# EAGLE design pots (EAGLE 6.6.0)
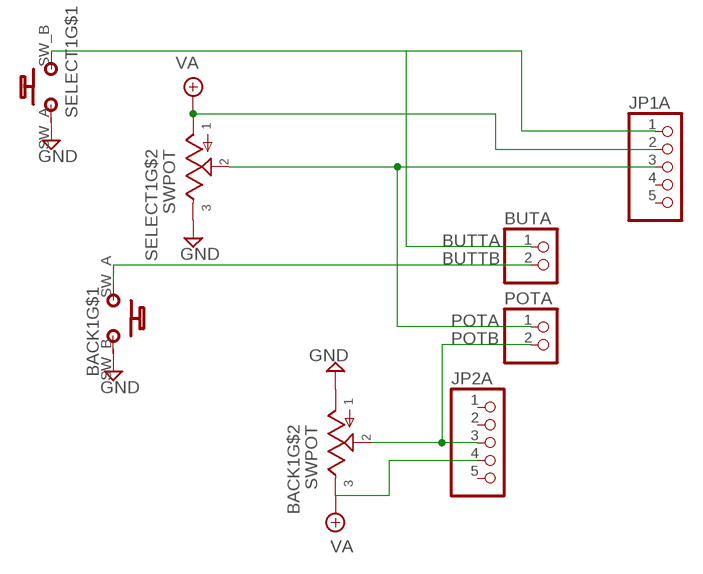
[diagram p0: schematic, sheet 1]

## Parts
BACK1  SWPOT  [SWPOT]
BUTA  PINHD-1X2  [1X02]
JP1A  PINHD-1X5  [1X05]
JP2A  PINHD-1X5  [1X05]
POTA  PINHD-1X2  [1X02]
SELECT1  SWPOT  [SWPOT]

## Nets
BUTTA: BUTA.1 JP1A.1 SELECT1.SW_B(B_B)
BUTTB: BACK1.SW_A(B_A) BUTA.2
GND: BACK1.POT_B BACK1.SW_B(B_B) SELECT1.POT_A SELECT1.SW_A(B_A)
POTA: JP1A.3 POTA.1 SELECT1.POT_W
POTB: BACK1.POT_W JP2A.3 POTA.2
VA: BACK1.POT_A JP1A.2 JP2A.4 SELECT1.POT_B
Unconnected: JP1A.4 JP1A.5 JP2A.1 JP2A.2 JP2A.5

## Library data of the parts
BACK1 SELECT1 = jaapie:SWPOT
BUTA POTA = pinhead:PINHD-1X2: PIN HEADER
JP1A JP2A = pinhead:PINHD-1X5: PIN HEADER

## Board
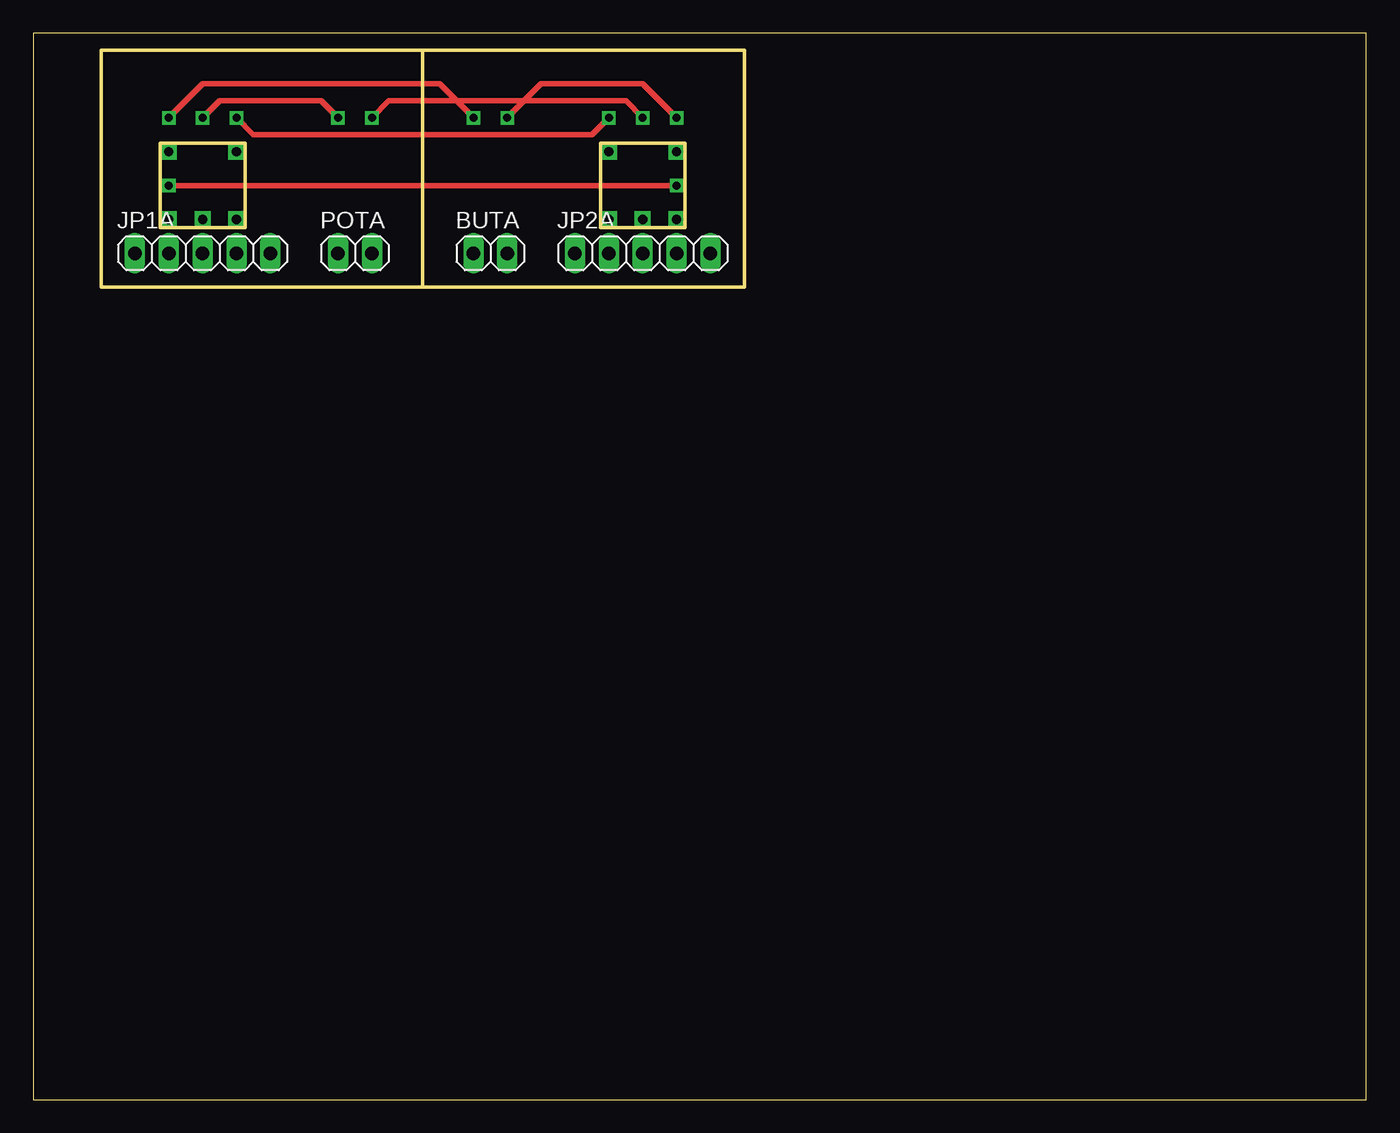
[diagram p1: board, top side]
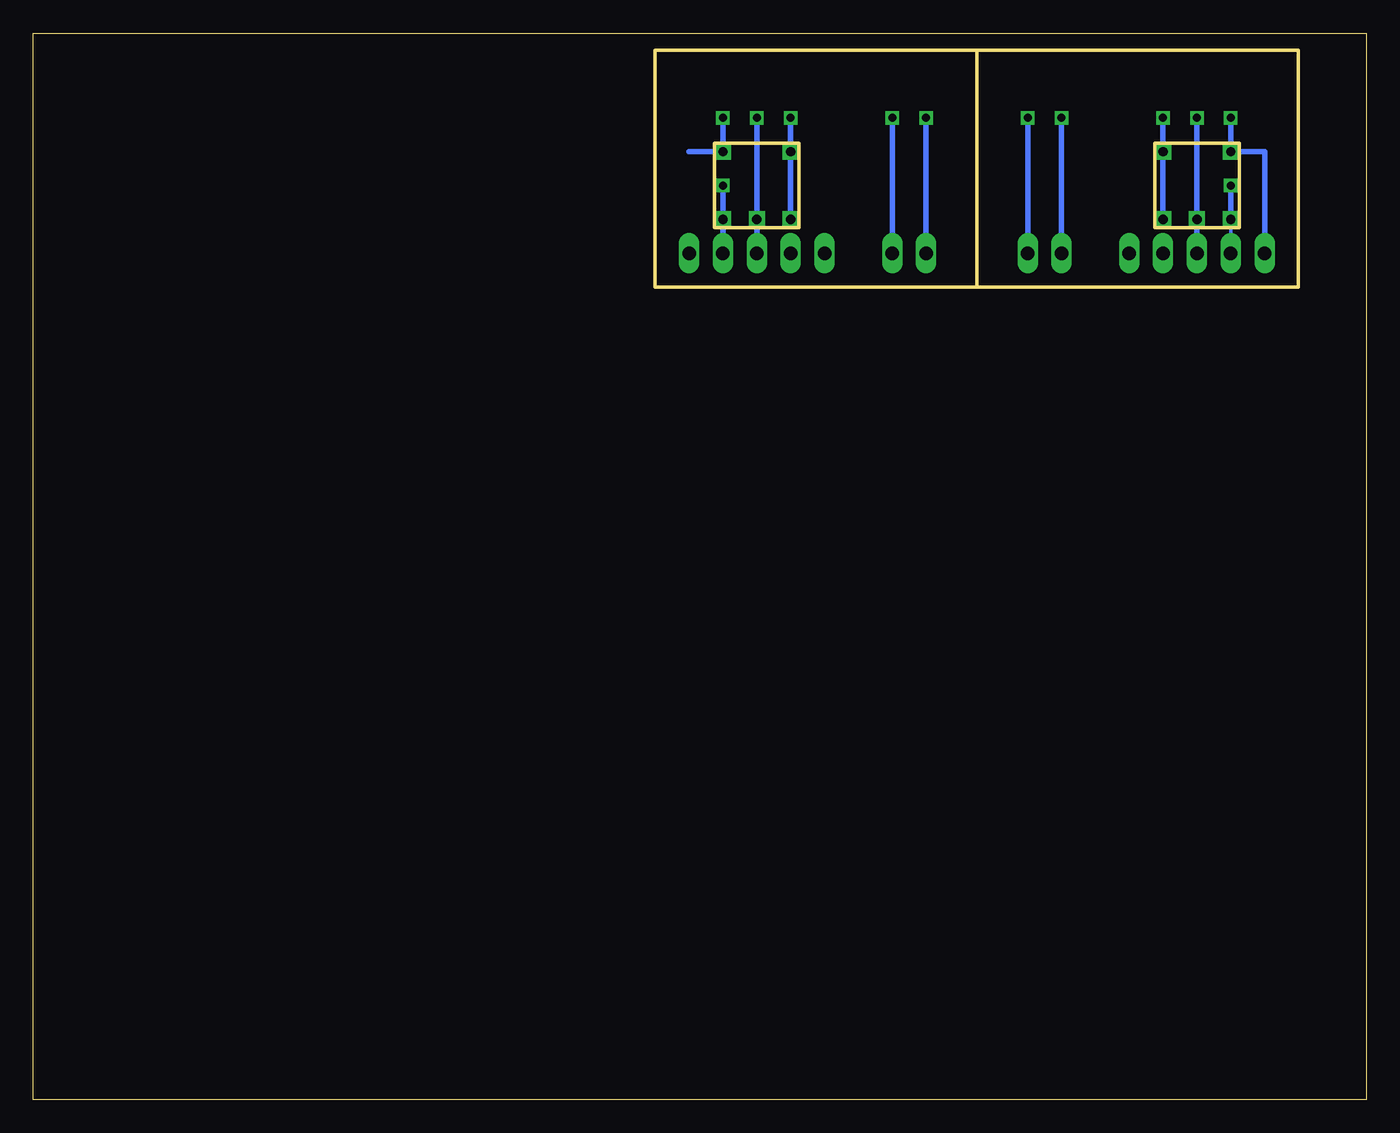
[diagram p2: board, bottom side, seen from below]

Size 100 x 80 mm. Coordinates in mm from the lower left corner, seen from the top.
Outline: 29.21,60.96 5.08,60.96 5.08,78.74 29.21,78.74
Outline: 29.21,60.96 53.34,60.96 53.34,78.74 29.21,78.74
Outline: 29.21,78.74 29.21,60.96
Outline: 0,0 100,0 100,80 0,80 0,0
Outline: 9.53,71.75 9.53,65.41 15.88,65.41 15.88,71.75 9.53,71.75
Outline: 42.55,71.75 48.9,71.75 48.9,65.41 42.55,65.41 42.55,71.75
Copper layers (1*16): Top 0.035mm / dielectric 1.5mm / Bottom 0.035mm
Design rules "default": minimum track width 10mil, minimum drill 24mil, track to track 8mil, track to pad 8mil, pad to pad 8mil, via to via 8mil, smd to smd 8mil, copper to edge 40mil, drill to drill 8mil, minimum pad ring 10mil, minimum via ring 8mil, stop-mask expansion 4mil, vias tented up to drill 0mil, thermal gap 10mil

### Footprints (pad centres in the part's own frame; a part is rotated, then mirrored left to right if it is on the bottom)
SWPOT = drill 0.7 square: POT_A -2.54,0; POT_B 2.54,0; POT_W 0,0; SW_A -2.54,-5.08; SW_B 2.54,-5.08
1X02 = drill 1.016 long: 1 -1.27,0; 2 1.27,0
1X05 = drill 1.016 long: 1 -5.08,0; 2 -2.54,0; 3 0,0; 4 2.54,0; 5 5.08,0

### Placement (x,y rotation side)
BACK1  45.72,66.04 180 top
BUTA  34.29,63.5 0 top
JP1A  12.7,63.5 0 top
JP2A  45.72,63.5 0 top
POTA  24.13,63.5 0 top
SELECT1  12.7,66.04 180 top

### Tracks (layer width: path | path; a pad name or v marks a point on that pad's centre or on a via)
BUTTA  (via drill 0.6)
  Top 0.406: v10.16,73.66 12.7,76.2 30.48,76.2 v33.02,73.66
  Bottom 0.406: JP1A.1 7.62,71.12 SELECT1.SW_B v10.16,73.66 | v33.02,73.66 BUTA.1
BUTTB  (via drill 0.6)
  Top 0.406: v35.56,73.66 38.1,76.2 45.72,76.2 v48.26,73.66
  Bottom 0.406: 50.8,71.12 BACK1.SW_A v48.26,73.66 | BUTA.2 v35.56,73.66
GND  (via drill 0.6)
  Top 0.406: v15.24,73.66 16.51,72.39 41.91,72.39 v43.18,73.66
  Bottom 0.406: SELECT1.POT_A SELECT1.SW_A v15.24,73.66 | BACK1.POT_B BACK1.SW_B v43.18,73.66
POTA  (via drill 0.6)
  Top 0.406: v12.7,73.66 13.97,74.93 21.59,74.93 v22.86,73.66
  Bottom 0.406: SELECT1.POT_W JP1A.3 v12.7,73.66 | v22.86,73.66 POTA.1
POTB  (via drill 0.6)
  Top 0.406: v25.4,73.66 26.67,74.93 44.45,74.93 v45.72,73.66
  Bottom 0.406: JP2A.3 BACK1.POT_W v45.72,73.66 | POTA.2 v25.4,73.66
VA  (via drill 0.6)
  Top 0.406: v10.16,68.58 v48.26,68.58
  Bottom 0.254: JP1A.2 SELECT1.POT_B
  Bottom 0.406: SELECT1.POT_B v10.16,68.58 | v48.26,68.58 BACK1.POT_A JP2A.4